# EAGLE design serialmonitor (EAGLE 6.2)
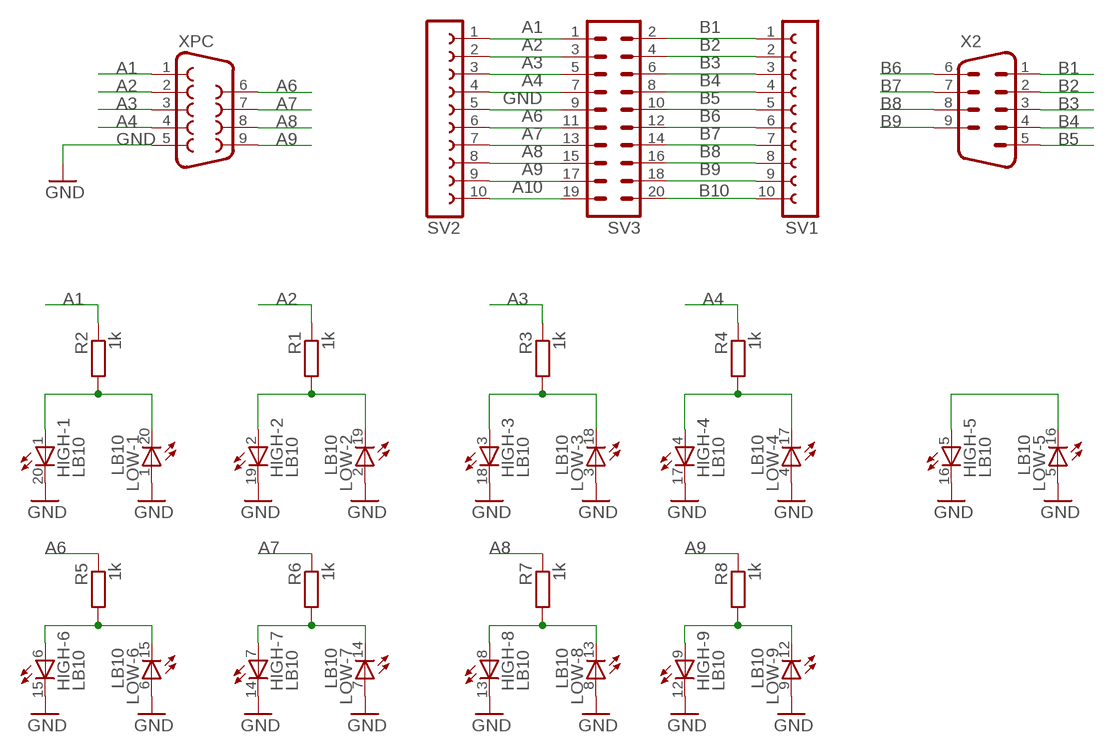
[diagram p0: schematic, sheet 1]

## Parts
HIGH  LB10  [LB10]
LOW  LB10  [LB10]
R1  1k  R-EU_M0805  [M0805]
R2  1k  R-EU_M0805  [M0805]
R3  1k  R-EU_M0805  [M0805]
R4  1k  R-EU_M0805  [M0805]
R5  1k  R-EU_M0805  [M0805]
R6  1k  R-EU_M0805  [M0805]
R7  1k  R-EU_M0805  [M0805]
R8  1k  R-EU_M0805  [M0805]
SV1  FE10-1  [FE10]
SV2  FE10-1  [FE10]
SV3  MA10-2  [MA10-2]
X2  M09D  [M09D]
XPC  F09D  [F09D]

## Nets
A1: R2.1 SV2.1 SV3.1 XPC.1
A2: R1.1 SV2.2 SV3.3 XPC.2
A3: R3.1 SV2.3 SV3.5 XPC.3
A4: R4.1 SV2.4 SV3.7 XPC.4
A6: R5.1 SV2.6 SV3.11 XPC.6
A7: R6.1 SV2.7 SV3.13 XPC.7
A8: R7.1 SV2.8 SV3.15 XPC.8
A9: R8.1 SV2.9 SV3.17 XPC.9
A10: SV2.10 SV3.19
B1: SV1.1 SV3.2 X2.1
B2: SV1.2 SV3.4 X2.2
B3: SV1.3 SV3.6 X2.3
B4: SV1.4 SV3.8 X2.4
B5: SV1.5 SV3.10 X2.5
B6: SV1.6 SV3.12 X2.6
B7: SV1.7 SV3.14 X2.7
B8: SV1.8 SV3.16 X2.8
B9: SV1.9 SV3.18 X2.9
B10: SV1.10 SV3.20
GND: HIGH.12(-9:C) HIGH.13(-8:C) HIGH.14(-7:C) HIGH.15(-6:C) HIGH.16(-5:C) HIGH.17(-4:C) HIGH.18(-3:C) HIGH.19(-2:C) HIGH.20(-1:C) LOW.1(-1:A) LOW.2(-2:A) LOW.3(-3:A) LOW.4(-4:A) LOW.5(-5:A) LOW.6(-6:A) LOW.7(-7:A) LOW.8(-8:A) LOW.9(-9:A) SV2.5 SV3.9 XPC.5
N$1: HIGH.1(-1:A) LOW.20(-1:C) R2.2
N$2: HIGH.2(-2:A) LOW.19(-2:C) R1.2
N$3: HIGH.3(-3:A) LOW.18(-3:C) R3.2
N$4: HIGH.4(-4:A) LOW.17(-4:C) R4.2
N$5: HIGH.6(-6:A) LOW.15(-6:C) R5.2
N$6: HIGH.5(-5:A) LOW.16(-5:C)
N$7: HIGH.7(-7:A) LOW.14(-7:C) R6.2
N$8: HIGH.8(-8:A) LOW.13(-8:C) R7.2
N$9: HIGH.9(-9:A) LOW.12(-9:C) R8.2
Unconnected: HIGH.10(-10:A) HIGH.11(-10:C) LOW.10(-10:A) LOW.11(-10:C)

## Library data of the parts
HIGH LOW = led:LB10: LED BLOCK 10-LED bar graph, DIL, Siemens
R1-R8 = rcl:R-EU_: RESISTOR, European symbol
SV1 SV2 = con-lsta:FE10-1: FEMALE HEADER
SV3 = con-lstb:MA10-2: PIN HEADER
X2 = con-subd:M09: SUB-D
XPC = con-subd:F09: SUB-D

## Board
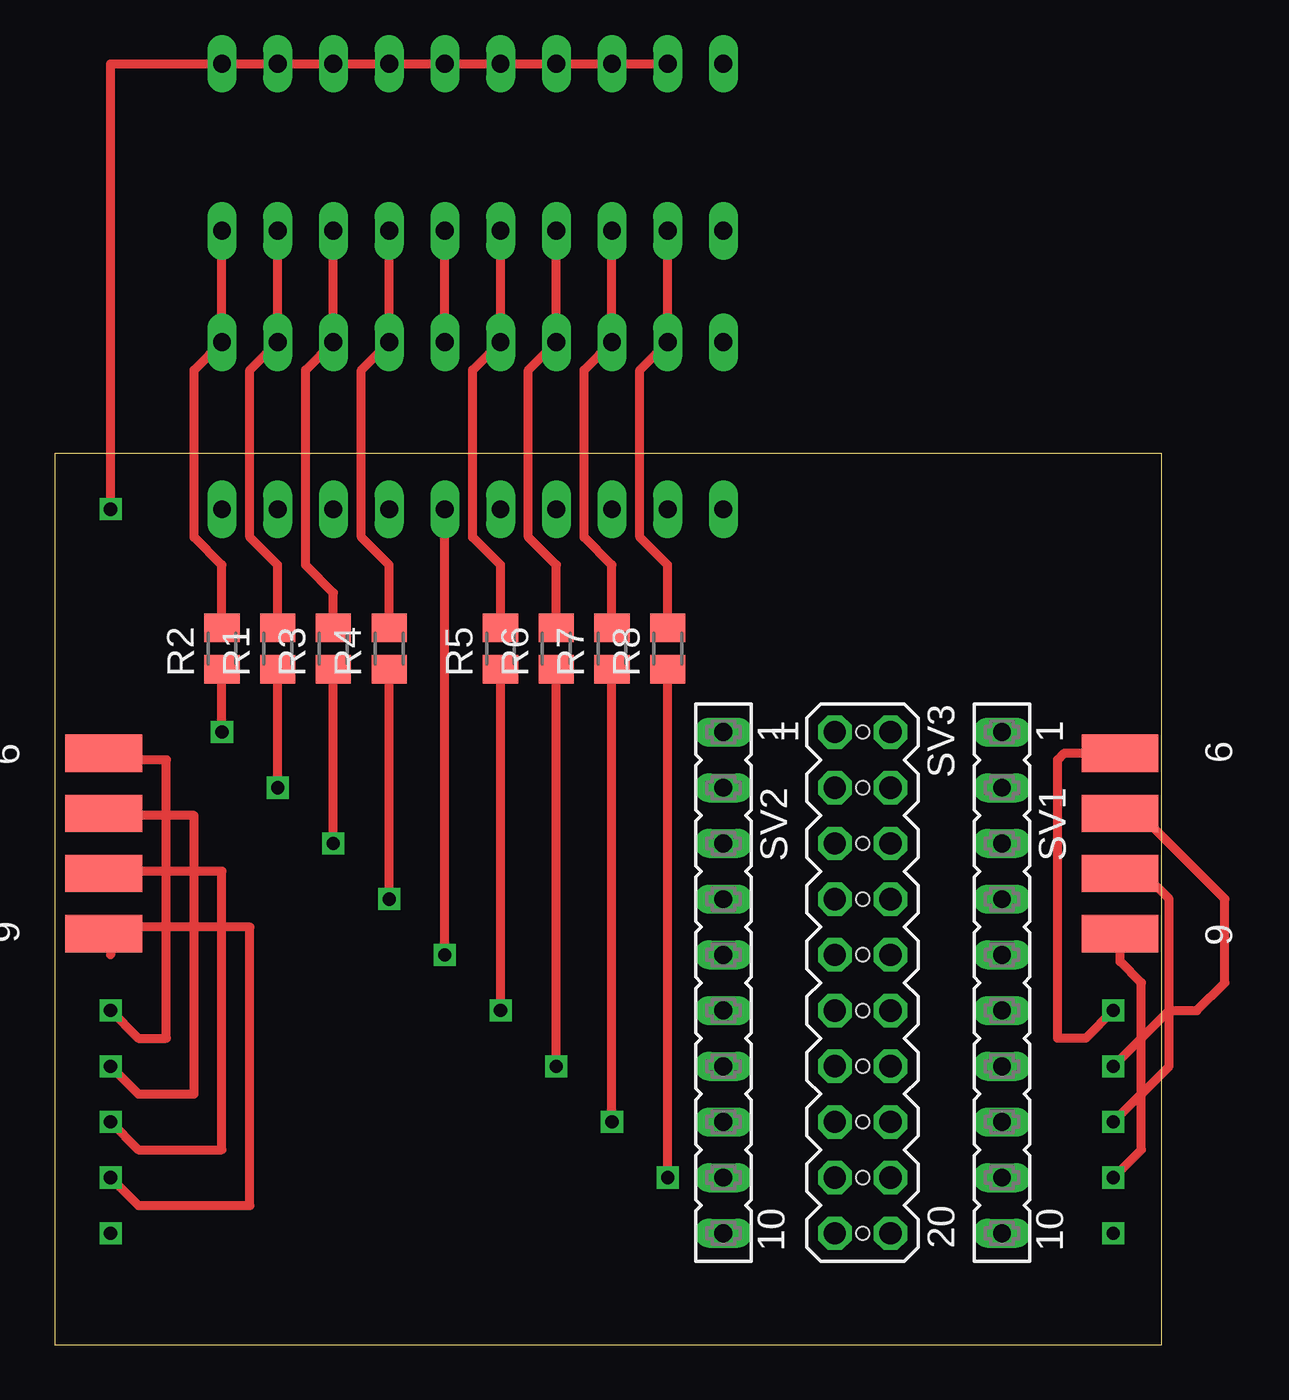
[diagram p1: board, top side]
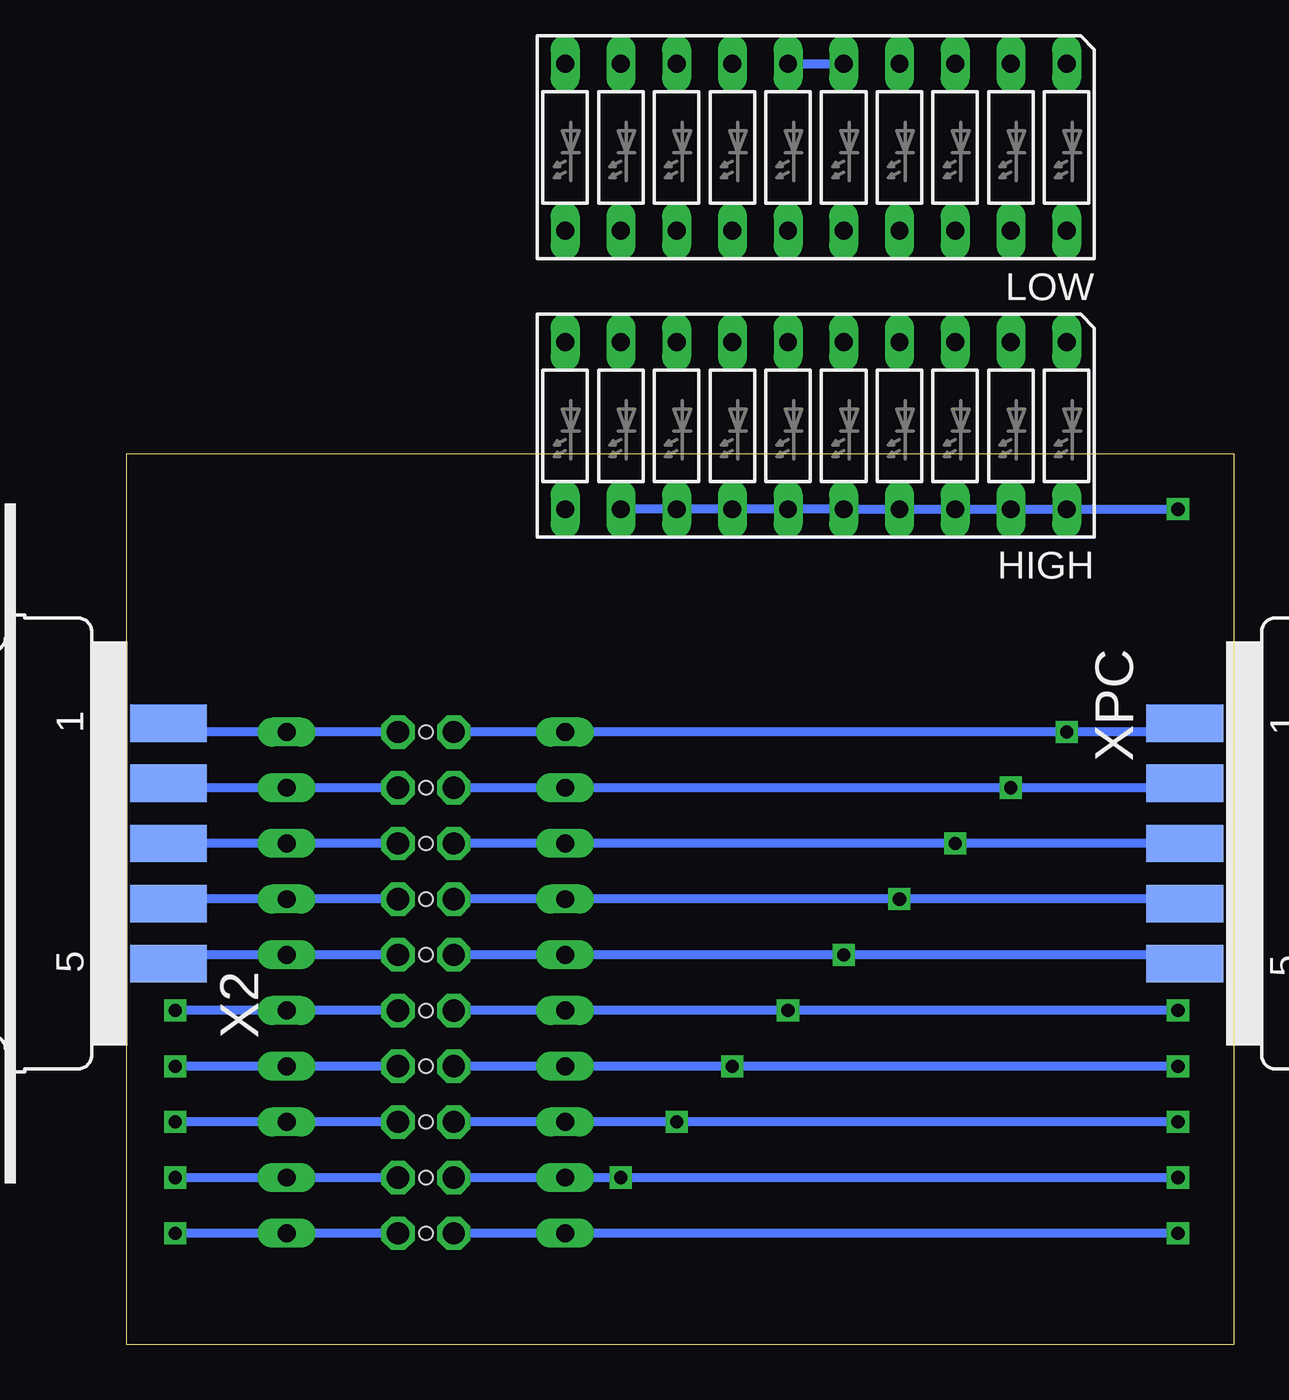
[diagram p2: board, bottom side, seen from below]

Size 50.47 x 40.63 mm. Coordinates in mm from the lower left corner, seen from the top.
Outline: 0,0 50.47,0 50.47,40.63 0,40.63 0,0
Copper layers (1*16): Top 0.035mm / dielectric 1.5mm / Bottom 0.035mm
Design rules: minimum track width 10mil, minimum drill 24mil, track to track 8mil, track to pad 8mil, pad to pad 8mil, via to via 8mil, smd to smd 8mil, copper to edge 40mil, drill to drill 8mil, minimum pad ring 10mil, minimum via ring 8mil, stop-mask expansion 4mil, vias tented up to drill 0mil, thermal gap 10mil
Holes 0.6 mm at 36.83,27.94 36.83,25.4 36.83,22.86 36.83,20.32 36.83,17.78 36.83,15.24 36.83,12.7 36.83,10.16 36.83,5.08 36.83,7.62

### Footprints (pad centres in the part's own frame; a part is rotated, then mirrored left to right if it is on the bottom)
LB10 = drill 0.813 long: 1 -11.43,-3.81; 2 -8.89,-3.81; 3 -6.35,-3.81; 4 -3.81,-3.81; 5 -1.27,-3.81; 6 1.27,-3.81; 7 3.81,-3.81; 8 6.35,-3.81; 9 8.89,-3.81; 10 11.43,-3.81; 11 11.43,3.81; 12 8.89,3.81; 13 6.35,3.81; 14 3.81,3.81; 15 1.27,3.81; 16 -1.27,3.81; 17 -3.81,3.81; 18 -6.35,3.81; 19 -8.89,3.81; 20 -11.43,3.81
M0805 = smd 1.3 x 1.6: 1 -0.95,0; 2 0.95,0
FE10 = drill 0.813 long: 1 -11.43,0; 2 -8.89,0; 3 -6.35,0; 4 -3.81,0; 5 -1.27,0; 6 1.27,0; 7 3.81,0; 8 6.35,0; 9 8.89,0; 10 11.43,0
MA10-2 = drill 1.016 octagon: 1 -11.43,-1.27; 2 -11.43,1.27; 3 -8.89,-1.27; 4 -8.89,1.27; 5 -6.35,-1.27; 6 -6.35,1.27; 7 -3.81,-1.27; 8 -3.81,1.27; 9 -1.27,-1.27; 10 -1.27,1.27; 11 1.27,-1.27; 12 1.27,1.27; 13 3.81,-1.27; 14 3.81,1.27; 15 6.35,-1.27; 16 6.35,1.27; 17 8.89,-1.27; 18 8.89,1.27; 19 11.43,-1.27; 20 11.43,1.27
M09D = smd 1.7 x 3.5: 1 5.486,-6.045; 2 2.743,-6.045; 3 0,-6.045; 4 -2.743,-6.045; 5 -5.486,-6.045 | smd 1.7 x 3.5 bottom: 6 4.115,-6.045; 7 1.372,-6.045; 8 -1.372,-6.045; 9 -4.115,-6.045
F09D = smd 1.7 x 3.5: 1 -5.486,-6.045; 2 -2.743,-6.045; 3 0,-6.045; 4 2.743,-6.045; 5 5.486,-6.045 | smd 1.7 x 3.5 bottom: 6 -4.115,-6.045; 7 -1.372,-6.045; 8 1.372,-6.045; 9 4.115,-6.045

### Placement (x,y rotation side)
HIGH  19.05,41.91 180 bottom
LOW  19.05,54.61 180 bottom  (outside the outline)
R1  10.16,31.75 90 top
R2  7.62,31.75 90 top
R3  12.7,31.75 90 top
R4  15.24,31.75 90 top
R5  20.32,31.75 90 top
R6  22.86,31.75 90 top
R7  25.4,31.75 90 top
R8  27.94,31.75 90 top
SV1  43.18,16.51 270 top
SV2  30.48,16.51 270 top
SV3  36.83,16.51 270 top
X2  54.61,22.86 90 bottom
XPC  -3.81,22.86 270 bottom

### Tracks (layer width: path | path; a pad name or v marks a point on that pad's centre or on a via)
A1  (via drill 0.6)
  Top 0.406: v7.62,27.94 R2.1
  Bottom 0.406: SV3.1 SV2.1 v7.62,27.94 2.54,27.94 2.13,28.35 XPC.1
A2  (via drill 0.6)
  Top 0.406: v10.16,25.4 R1.1
  Bottom 0.406: SV3.3 SV2.2 v10.16,25.4 2.54,25.4 2.34,25.6 XPC.2
A3  (via drill 0.6)
  Top 0.406: v12.7,22.86 R3.1
  Bottom 0.406: SV3.5 SV2.3 v12.7,22.86 XPC.3
A4  (via drill 0.6)
  Top 0.406: v15.24,20.32 R4.1
  Bottom 0.406: SV3.7 SV2.4 v15.24,20.32 2.54,20.32 2.34,20.12 XPC.4
A6  (via drill 0.6)
  Top 0.406: v20.32,15.24 R5.1 | v2.54,15.24 3.81,13.97 5.08,13.97 5.08,26.67 2.54,26.67 XPC.6
  Bottom 0.406: SV3.11 SV2.6 v20.32,15.24 v2.54,15.24
A7  (via drill 0.6)
  Top 0.406: v22.86,12.7 R6.1 | v2.54,12.7 3.81,11.43 6.35,11.43 6.35,24.13 2.34,24.13 XPC.7
  Bottom 0.406: SV3.13 SV2.7 v22.86,12.7 v2.54,12.7
A8  (via drill 0.6)
  Top 0.406: v25.4,10.16 R7.1 | v2.54,10.16 3.81,8.89 7.62,8.89 7.62,21.59 2.34,21.59 XPC.8
  Bottom 0.406: SV3.15 SV2.8 v25.4,10.16 v2.54,10.16
A9  (via drill 0.6)
  Top 0.406: v27.94,7.62 R8.1 | 2.54,17.78 2.54,18.44 XPC.9 2.54,19.05 8.89,19.05 8.89,6.35 3.81,6.35 v2.54,7.62
  Bottom 0.406: SV3.17 SV2.9 v27.94,7.62 v2.54,7.62
A10  (via drill 0.6)
  Bottom 0.406: SV3.19 SV2.10 v2.54,5.08
B1
  Bottom 0.406: SV3.2 SV1.1 48.26,27.94 48.26,28.35 X2.1
B2
  Bottom 0.406: SV3.4 SV1.2 48.26,25.4 48.26,25.6 X2.2
B3
  Bottom 0.406: SV3.6 SV1.3 X2.3
B4
  Bottom 0.406: SV3.8 SV1.4 48.26,20.32 48.26,20.12 X2.4
B5
  Bottom 0.406: SV3.10 SV1.5 48.26,17.78 48.26,17.37 X2.5
B6  (via drill 0.6)
  Top 0.406: X2.6 46.02,26.98 45.72,26.67 45.72,13.97 46.99,13.97 v48.26,15.24
  Bottom 0.406: SV3.12 SV1.6 v48.26,15.24
B7  (via drill 0.6)
  Top 0.406: X2.7 49.43,24.23 53.34,20.32 53.34,16.51 52.07,15.24 50.8,15.24 v48.26,12.7
  Bottom 0.406: SV3.14 SV1.7 v48.26,12.7
B8  (via drill 0.6)
  Top 0.406: X2.8 49.63,21.49 50.8,20.32 50.8,12.7 v48.26,10.16
  Bottom 0.406: SV3.16 SV1.8 v48.26,10.16
B9  (via drill 0.6)
  Top 0.406: X2.9 48.56,17.48 49.53,16.51 49.53,8.89 v48.26,7.62
  Bottom 0.406: SV3.18 SV1.9 v48.26,7.62
B10  (via drill 0.6)
  Bottom 0.406: SV3.20 SV1.10 v48.26,5.08
GND  (via drill 0.6)
  Top 0.406: LOW.9 LOW.8 LOW.7 LOW.6 LOW.4 LOW.3 LOW.2 LOW.1 2.54,58.42 v2.54,38.1 | v17.78,17.78 HIGH.16
  Bottom 0.406: HIGH.12 HIGH.13 HIGH.14 HIGH.15 HIGH.16 HIGH.17 HIGH.18 HIGH.19 HIGH.20 v2.54,38.1 | SV3.9 SV2.5 v17.78,17.78 2.54,17.78 2.13,17.37 XPC.5 | LOW.6 LOW.5
N$1
  Top 0.406: LOW.20 HIGH.1 6.35,44.45 6.35,36.83 7.62,35.56 R2.2
N$2
  Top 0.406: LOW.19 HIGH.2 8.89,44.45 8.89,36.83 10.16,35.56 R1.2
N$3
  Top 0.406: LOW.18 HIGH.3 11.43,44.45 11.43,35.56 12.7,34.29 R3.2
N$4
  Top 0.406: LOW.17 HIGH.4 13.97,44.45 13.97,36.83 15.24,35.56 R4.2
N$5
  Top 0.406: LOW.15 HIGH.6 19.05,44.45 19.05,36.83 20.32,35.56 R5.2
N$6
  Top 0.406: HIGH.5 LOW.16
N$7
  Top 0.406: LOW.14 HIGH.7 21.59,44.45 21.59,36.83 22.86,35.56 R6.2
N$8
  Top 0.406: LOW.13 HIGH.8 24.13,44.45 24.13,36.83 25.4,35.56 R7.2
N$9
  Top 0.406: LOW.12 HIGH.9 26.67,44.45 26.67,36.83 27.94,35.56 R8.2

### Text on the board
tDocu: CD | RXD | TXD | DTA | GND | DSR | RTS | CTS | RI